# EAGLE design expander8 (EAGLE 6.1)
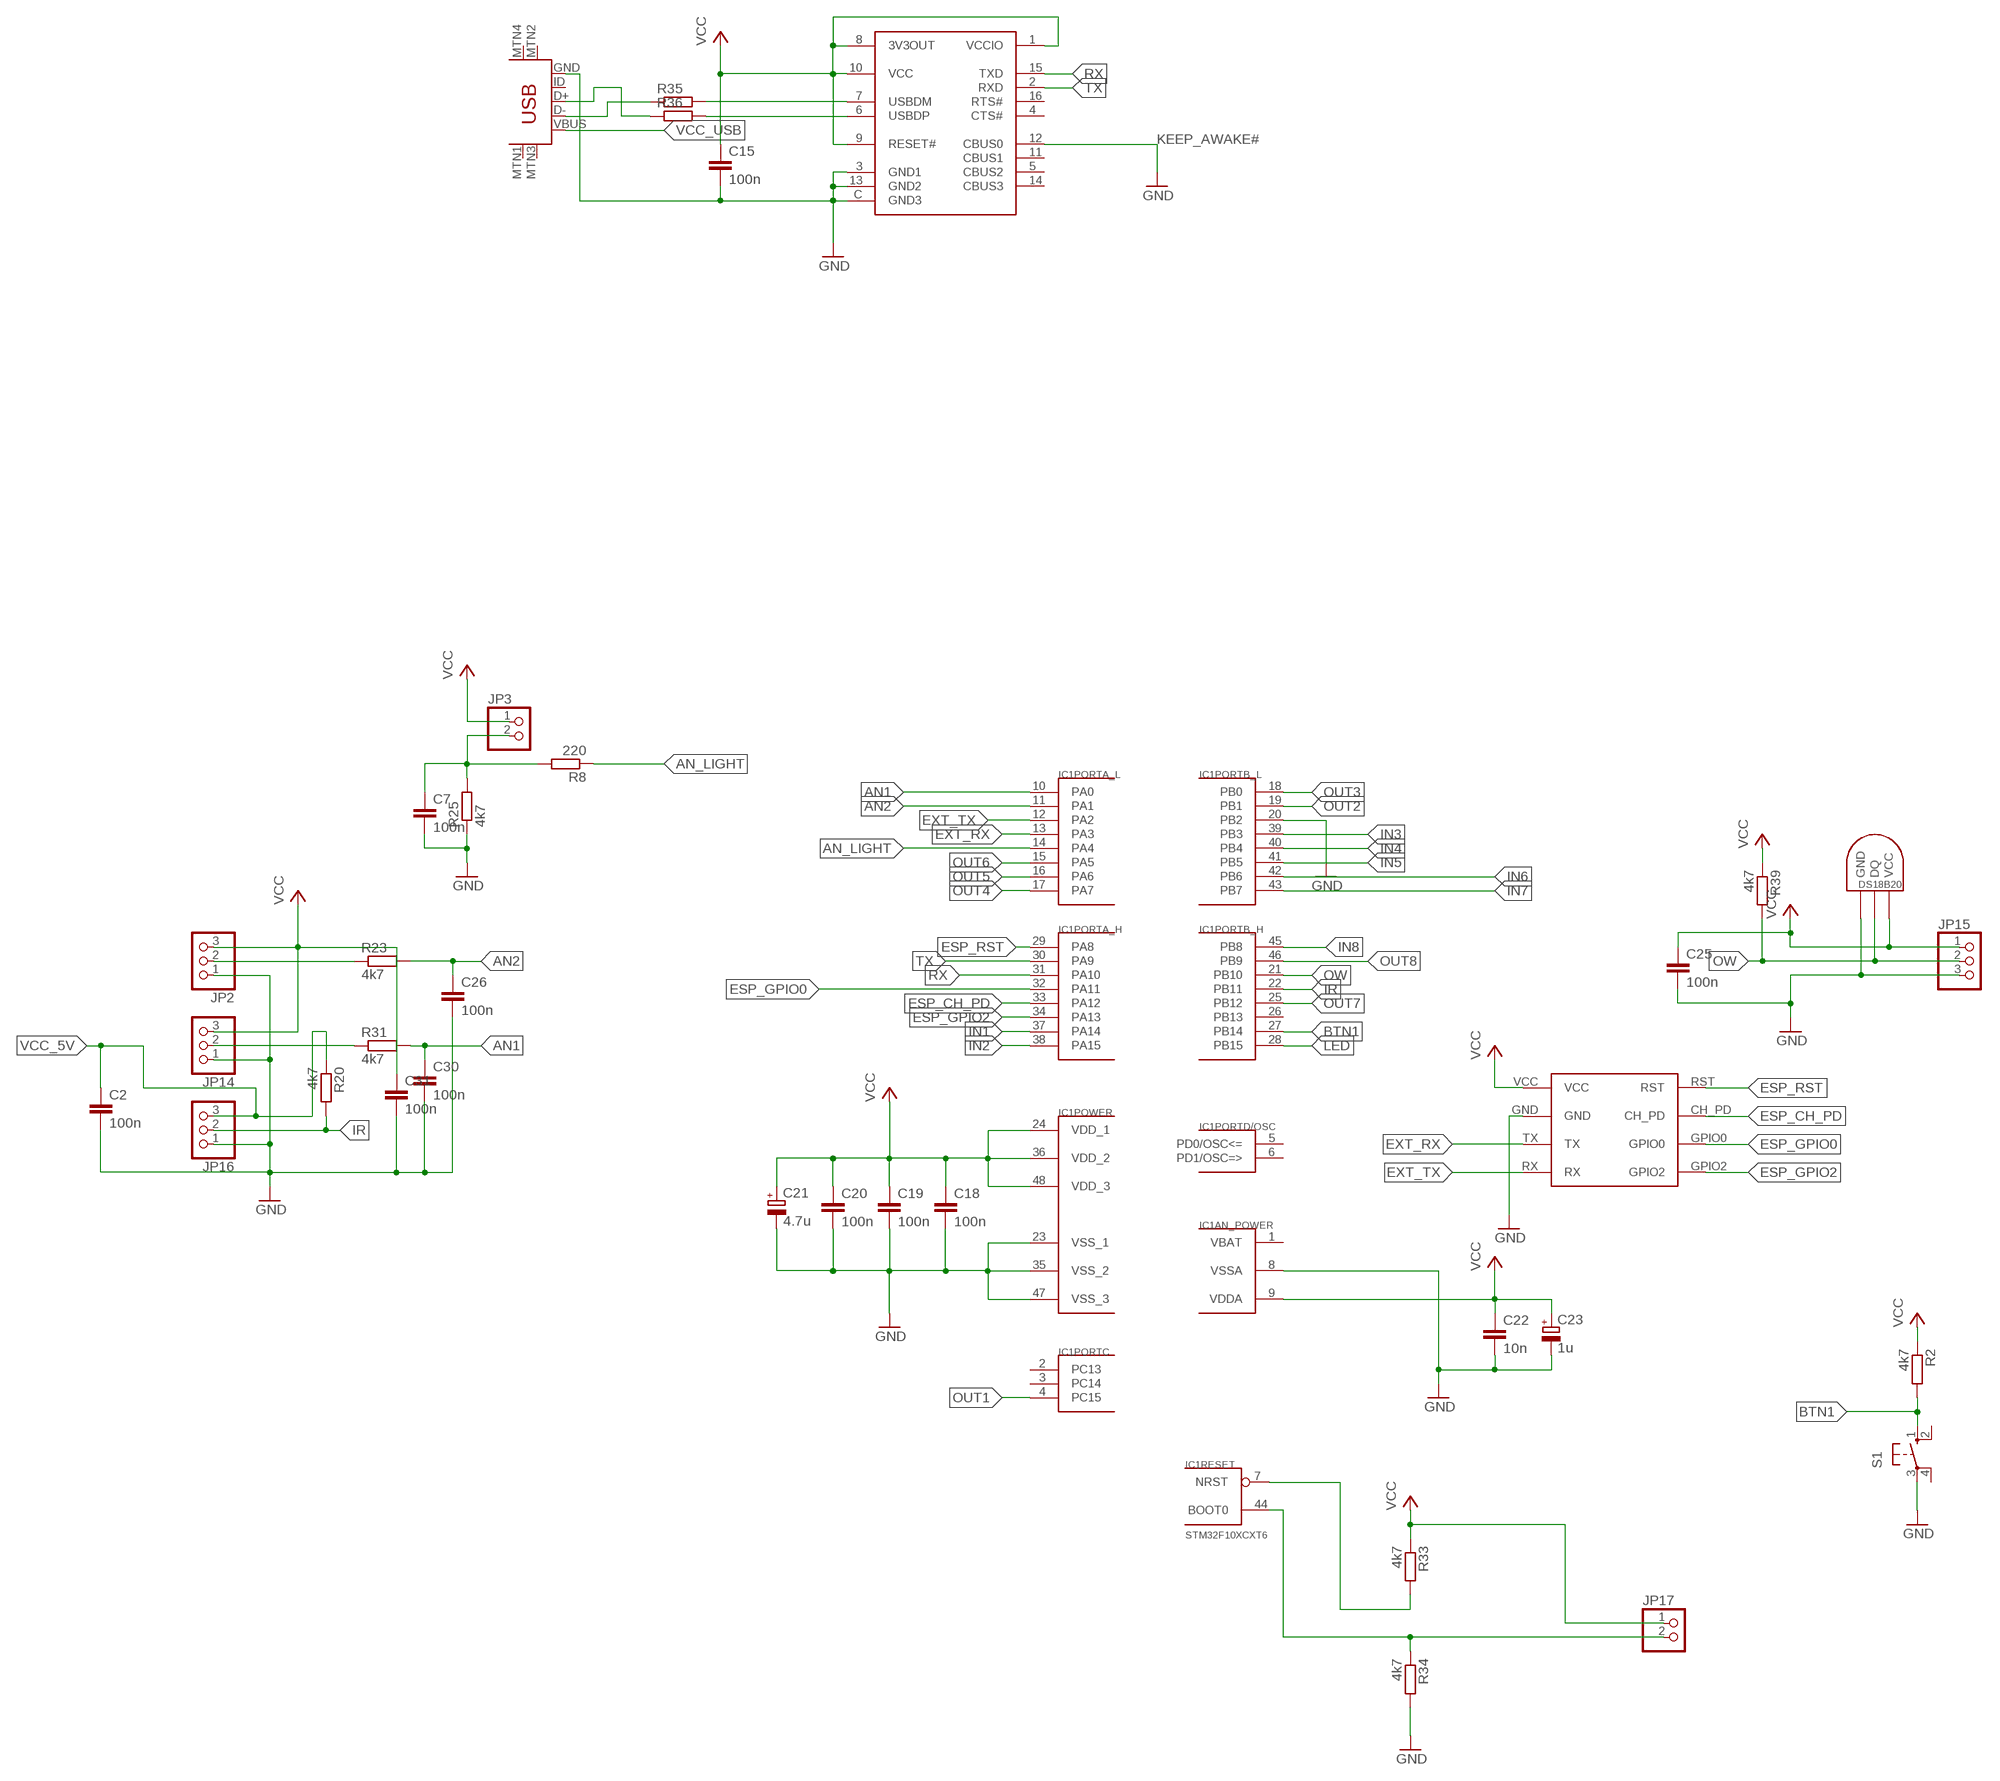
[diagram p0: schematic, sheet 1, part 1 of 3]
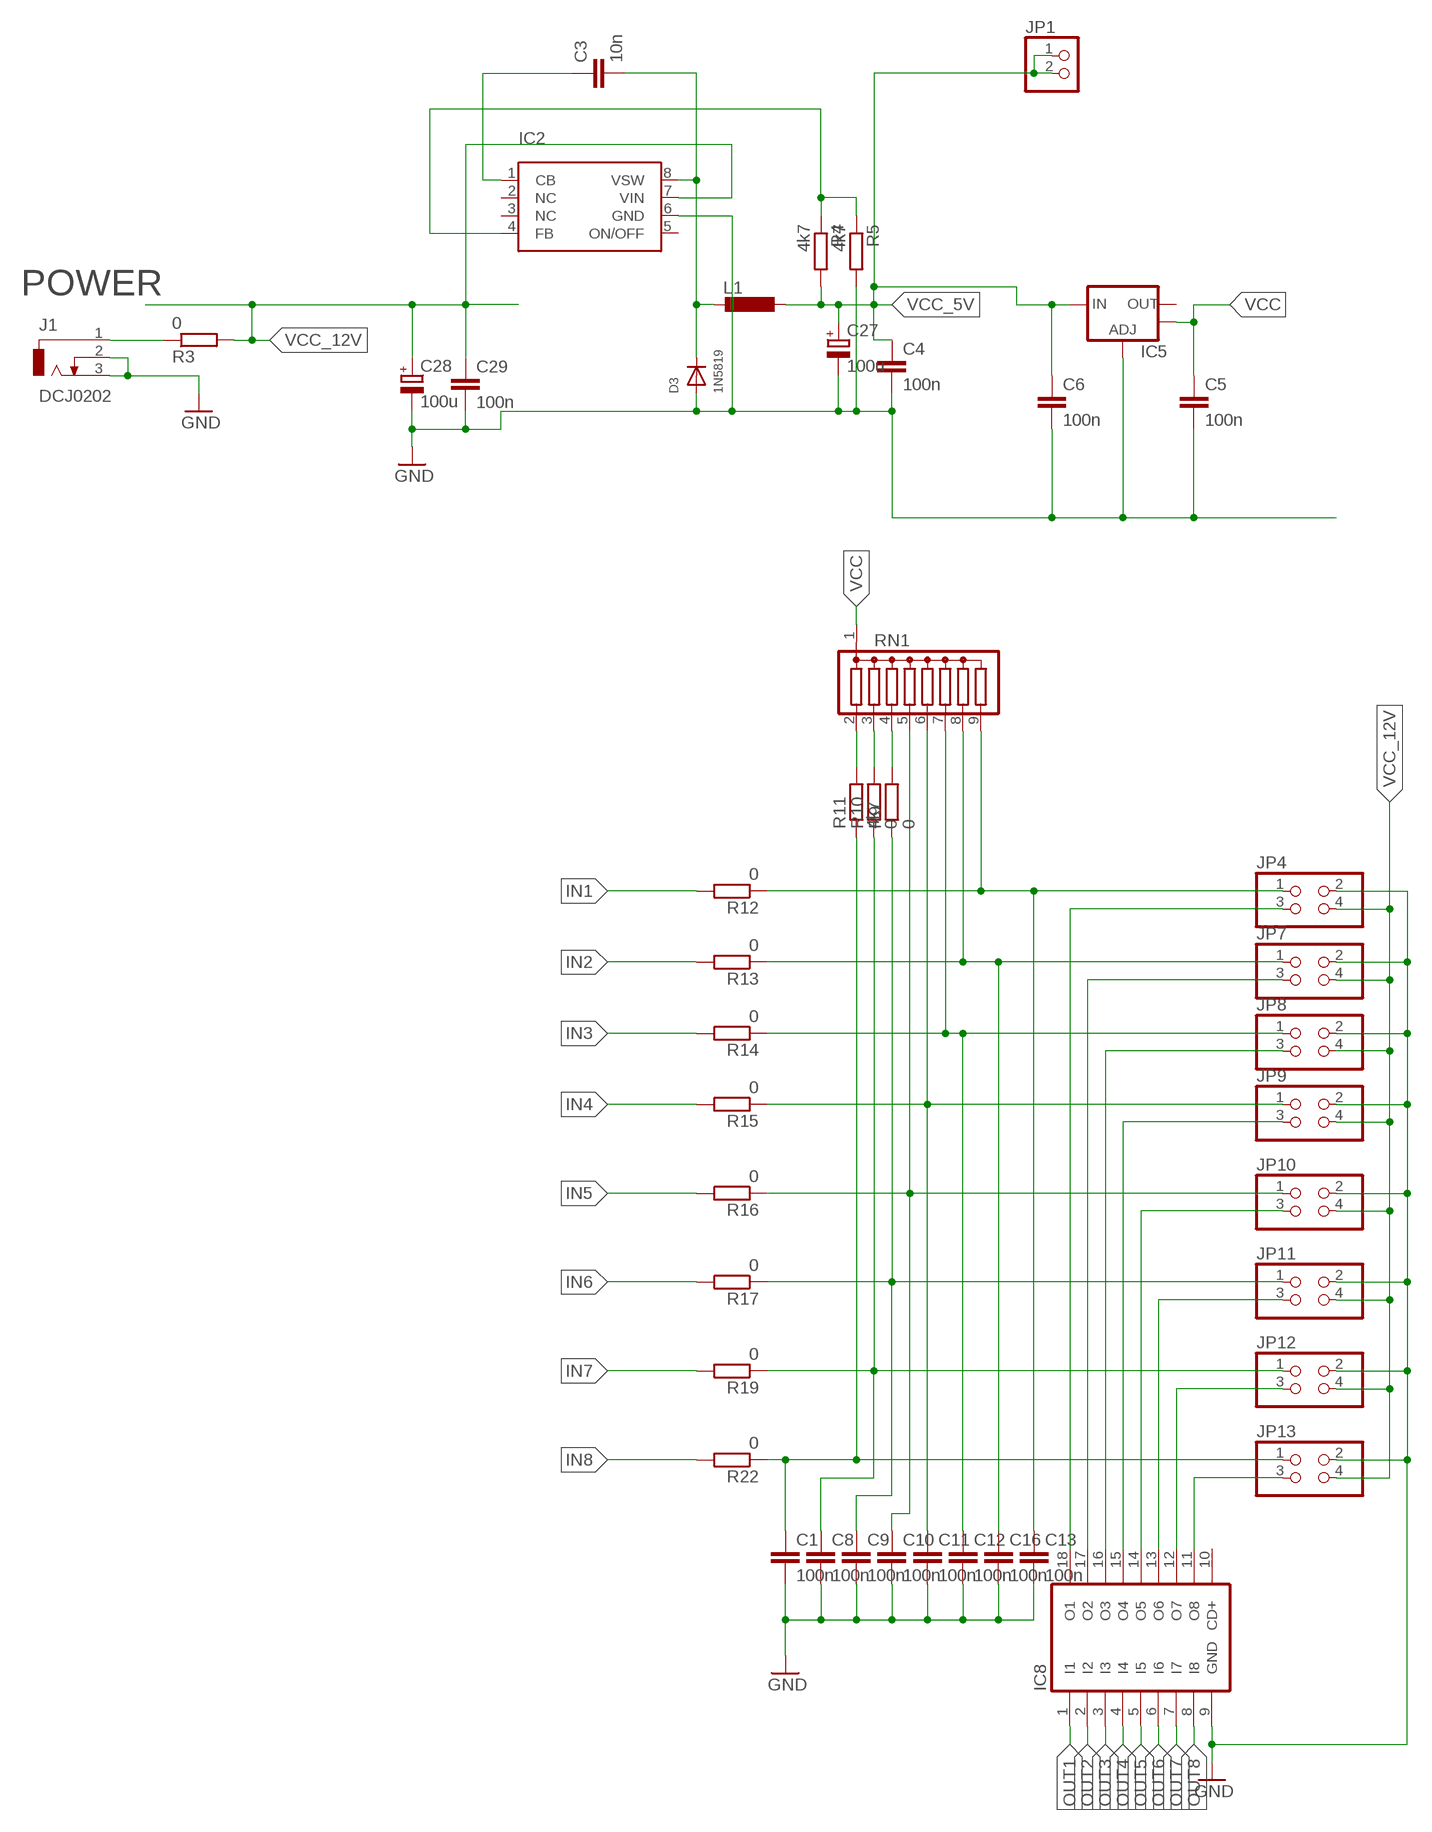
[diagram p1: schematic, sheet 1, part 2 of 3]
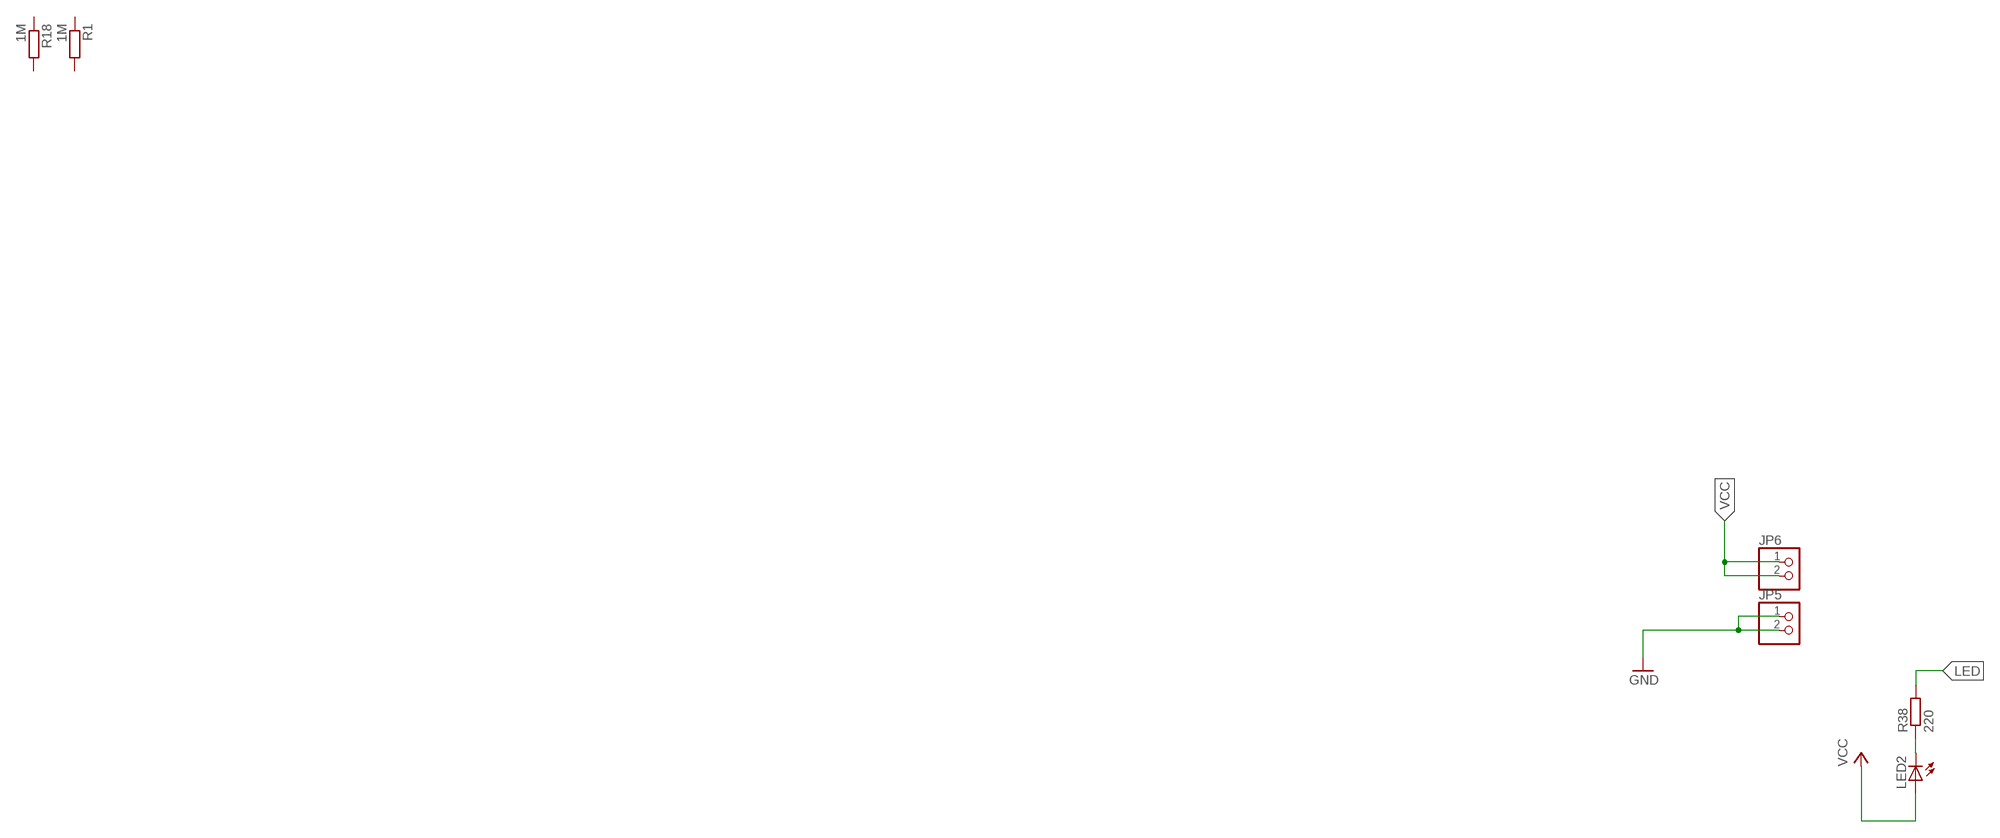
[diagram p2: schematic, sheet 1, part 3 of 3]

## Parts
C1  100n  C-EUC0805  [C0805]
C2  100n  C-EUC0805  [C0805]
C3  10n  C-EUC1206  [C1206]
C4  100n  C-EUC0805  [C0805]
C5  100n  C-EUC0805  [C0805]
C6  100n  C-EUC0805  [C0805]
C7  100n  C-EUC0805  [C0805]
C8  100n  C-EUC0805  [C0805]
C9  100n  C-EUC0805  [C0805]
C10  100n  C-EUC0805  [C0805]
C11  100n  C-EUC0805  [C0805]
C12  100n  C-EUC0805  [C0805]
C13  100n  C-EUC0805  [C0805]
C15  100n  C-EUC0805  [C0805]
C16  100n  C-EUC0805  [C0805]
C18  100n  C-EUC0805  [C0805]
C19  100n  C-EUC0805  [C0805]
C20  100n  C-EUC0805  [C0805]
C21  4.7u  CPOL-EUE2.5-5  [E2,5-5]
C22  10n  C-EUC0805  [C0805]
C23  1u  CPOL-EUE2.5-5  [E2,5-5]
C25  100n  C-EUC0805  [C0805]
C26  100n  C-EUC0805  [C0805]
C27  100u  CPOL-EUE2.5-7  [E2,5-7]
C28  100u  CPOL-EUE2.5-7  [E2,5-7]
C29  100n  C-EUC0805  [C0805]
C30  100n  C-EUC0805  [C0805]
C31  100n  C-EUC1206  [C1206]
D3  1N5819  DIODESMA  [SMADIODE]
IC1  STM32F10XCXT6  [TQFP48]
IC2  LM2674  [SO8]
IC5  V_REG_LM1117SOT223  [SOT223]
IC8  ULN2803AD  [SO18W]
J1  DCJ0202  [DCJ0202]
JP1  PINHD-1X2_2.54  [1X02]
JP2  PINHD-1X3  [1X03]
JP3  PINHD-1X2  [1X02]
JP4  PINHD-2X2/90  [2X02/90]
JP5  PINHD-1X2  [1X02]
JP6  PINHD-1X2  [1X02]
JP7  PINHD-2X2/90  [2X02/90]
JP8  PINHD-2X2/90  [2X02/90]
JP9  PINHD-2X2/90  [2X02/90]
JP10  PINHD-2X2/90  [2X02/90]
JP11  PINHD-2X2/90  [2X02/90]
JP12  PINHD-2X2/90  [2X02/90]
JP13  PINHD-2X2/90  [2X02/90]
JP14  PINHD-1X3  [1X03]
JP15  PINHD-1X3  [1X03]
JP16  PINHD-1X3  [1X03]
JP17  PINHD-1X2_2.54  [1X02]
L1  L-EU0207/2V  [0207/2V]
LED2  LEDCHIPLED_0805  [CHIPLED_0805]
R1  1M  R-EU_R1206  [R1206]
R2  4k7  R-EU_R0805  [R0805]
R3  0  R-EU_M1206  [M1206]
R4  4k7  R-EU_R0805  [R0805]
R5  4k7  R-EU_R0805  [R0805]
R8  220  R-EU_R1206  [R1206]
R9  0  R-EU_R0805  [R0805]
R10  0  R-EU_R0805  [R0805]
R11  4k7  R-EU_R0805  [R0805]
R12  0  R-EU_R0805  [R0805]
R13  0  R-EU_R0805  [R0805]
R14  0  R-EU_R0805  [R0805]
R15  0  R-EU_R0805  [R0805]
R16  0  R-EU_R0805  [R0805]
R17  0  R-EU_R0805  [R0805]
R18  1M  R-EU_R1206  [R1206]
R19  0  R-EU_R0805  [R0805]
R20  4k7  R-EU_R0805  [R0805]
R22  0  R-EU_R0805  [R0805]
R23  4k7  R-EU_R0805  [R0805]
R25  4k7  R-EU_R0805  [R0805]
R31  4k7  R-EU_R1206  [R1206]
R33  4k7  R-EU_R0805  [R0805]
R34  4k7  R-EU_R0805  [R0805]
R35  R-EU_R1206  [R1206]
R36  R-EU_R0805  [R0805]
R38  220  R-EU_R0805  [R0805]
R39  4k7  R-EU_R0805  [R0805]
RN1  G08R  [SIL9]
S1  10-XX  [B3F-10XX]
U$1  ESP8266  [ESP8266]
U$2  USB-MINIB-5PIN  [USB-MINIB]
U$3  FT230XQ  [FT230XQ]
U$4  DS1820TO92  [DS1820]

## Nets
AN1: C30.1 IC1.10(PORTA_L:PA0) R31.2
AN2: C26.1 IC1.11(PORTA_L:PA1) R23.2
AN_LIGHT: IC1.14(PORTA_L:PA4) R8.1
AN_LIGHT2: C7.1 JP3.2 R8.2 R25.2
BTN1: IC1.27(PORTB_H:PB14) R2.2 S1.1(S)
ESP_CH_PD: IC1.33(PORTA_H:PA12) U$1.CH_PD
ESP_GPIO0: IC1.32(PORTA_H:PA11) U$1.GPIO0
ESP_GPIO2: IC1.34(PORTA_H:PA13) U$1.GPIO2
ESP_RST: IC1.29(PORTA_H:PA8) U$1.RST
EXT_RX: IC1.13(PORTA_L:PA3) U$1.TX
EXT_TX: IC1.12(PORTA_L:PA2) U$1.RX
GND: C1.2 C2.2 C4.2 C5.2 C6.2 C7.2 C8.2 C9.2 C10.2 C11.2 C12.2 C13.2 C15.2 C16.2 C18.2 C19.2 C20.2 C21.- C22.2 C23.- C25.2 C26.2 C27.- C28.- C29.2 C30.2 C31.2 D3.A IC1.8(AN_POWER:VSSA) IC1.20(PORTB_L:PB2) IC1.23(POWER:VSS_1) IC1.35(POWER:VSS_2) IC1.47(POWER:VSS_3) IC2.6(GND) IC5.1(ADJ) IC8.9(GND) J1.2 J1.3 JP2.1 JP4.2 JP5.1 JP5.2 JP7.2 JP8.2 JP9.2 JP10.2 JP11.2 JP12.2 JP13.2 JP14.1 JP15.3 JP16.1 R5.2 R25.1 R34.2 S1.3(P) U$1.GND U$2.GND U$3.3(GND1) U$3.12(CBUS0) U$3.13(GND2) U$3.C(GND3) U$4.GND
IN1: IC1.37(PORTA_H:PA14) R12.2
IN1_: C13.1 JP4.1 R12.1 RN1.9
IN2: IC1.38(PORTA_H:PA15) R13.2
IN2_: C16.1 JP7.1 R13.1 RN1.8
IN3: IC1.39(PORTB_L:PB3) R14.2
IN3_: C12.1 JP8.1 R14.1 RN1.7
IN4: IC1.40(PORTB_L:PB4) R15.2
IN4_: C11.1 JP9.1 R15.1 RN1.6
IN5: IC1.41(PORTB_L:PB5) R16.2
IN5_: C10.1 JP10.1 R16.1 RN1.5
IN6: IC1.42(PORTB_L:PB6) R17.2
IN6_: C9.1 JP11.1 R9.1 R17.1
IN7: IC1.43(PORTB_L:PB7) R19.2
IN7_: C8.1 JP12.1 R10.1 R19.1
IN8: IC1.45(PORTB_H:PB8) R22.2
IN8_: C1.1 JP13.1 R11.1 R22.1
IR: IC1.22(PORTB_H:PB11) JP16.2 R20.2
LED: IC1.28(PORTB_H:PB15) R38.2
N$1: C3.2 D3.C IC2.8(VSW) L1.2
N$2: IC2.4(FB) R4.1 R5.1
N$3: IC8.18(O1) JP4.3
N$5: IC8.17(O2) JP7.3
N$6: C3.1 IC2.1(CB)
N$7: J1.1 R3.1
N$11: IC8.16(O3) JP8.3
N$12: R9.2 RN1.4
N$13: IC8.15(O4) JP9.3
N$14: R10.2 RN1.3
N$15: R11.2 RN1.2
N$23: IC8.14(O5) JP10.3
N$24: IC8.13(O6) JP11.3
N$25: IC8.12(O7) JP12.3
N$26: LED2.C R38.1
N$29: IC8.11(O8) JP13.3
N$31: JP2.2 R23.1
N$32: JP14.2 R31.1
N$38: R35.1 U$2.D-
N$39: R35.2 U$3.7(USBDM)
N$40: R36.2 U$3.6(USBDP)
N$41: R36.1 U$2.D+
N$64: IC1.44(RESET:BOOT0) JP17.2 R34.1
OUT1: IC1.4(PORTC:PC15) IC8.1(I1)
OUT2: IC1.19(PORTB_L:PB1) IC8.2(I2)
OUT3: IC1.18(PORTB_L:PB0) IC8.3(I3)
OUT4: IC1.17(PORTA_L:PA7) IC8.4(I4)
OUT5: IC1.16(PORTA_L:PA6) IC8.5(I5)
OUT6: IC1.15(PORTA_L:PA5) IC8.6(I6)
OUT7: IC1.25(PORTB_H:PB12) IC8.7(I7)
OUT8: IC1.46(PORTB_H:PB9) IC8.8(I8)
OW: IC1.21(PORTB_H:PB10) JP15.2 R39.2 U$4.DQ
RST1: IC1.7(RESET:NRST) R33.2
RX: IC1.31(PORTA_H:PA10) U$3.15(TXD)
TX: IC1.30(PORTA_H:PA9) U$3.2(RXD)
VCC: C5.1 C15.1 C18.1 C19.1 C20.1 C21.+ C22.1 C23.+ C25.1 C31.1 IC1.9(AN_POWER:VDDA) IC1.24(POWER:VDD_1) IC1.36(POWER:VDD_2) IC1.48(POWER:VDD_3) IC5.4(OUT) JP2.3 JP3.1 JP6.1 JP6.2 JP14.3 JP15.1 JP17.1 LED2.A R2.1 R33.1 R39.1 RN1.1 U$1.VCC U$3.1(VCCIO) U$3.8(3V3OUT) U$3.9(RESET#) U$3.10(VCC) U$4.VDD(VCC)
VCC_5V: C2.1 C4.1 C6.1 C27.+ IC5.3(IN) JP1.1 JP1.2 JP16.3 L1.1 R4.2 R20.1
VCC_12V: C28.+ C29.1 IC2.7(VIN) JP4.4 JP7.4 JP8.4 JP9.4 JP10.4 JP11.4 JP12.4 JP13.4 R3.2
VCC_USB: U$2.VBUS
Unconnected: IC1.2(PORTC:PC13) IC1.3(PORTC:PC14) IC1.5(PORTD/OSC:PD0/OSC<=) IC1.6(PORTD/OSC:PD1/OSC=>) IC1.26(PORTB_H:PB13) IC2.2(NC) IC2.3(NC) IC2.5(ON/OFF) IC5.2(OUT) IC8.10(CD+) R1.1 R1.2 R18.1 R18.2 S1.2(S1) S1.4(P1) U$2.ID U$2.MTN1(MTN2) U$2.MTN2(MTN3) U$2.MTN3(MTN1) U$2.MTN4 U$3.4(CTS#) U$3.5(CBUS2) U$3.11(CBUS1) U$3.14(CBUS3) U$3.16(RTS#)

## Notes on the sheet
- POWER
- KEEP_AWAKE#

## Power pins joined to a net without a drawn wire
VBAT: IC1.1(AN_POWER:VBAT)

## Library data of the parts
C1-C13 C15 C16 C18-C20 C22 C26 C29-C31 = rcl-kd:C-EU: CAPACITOR, European symbol
C21 C23 C27 C28 = rcl-kd:CPOL-EU: POLARIZED CAPACITOR, European symbol
C25 = resistor:C-EU: CAPACITOR, European symbol
D3 = adafruit:DIODE: Diode SMADIODE - SMA Surface Mount Package 20V 1A Schottky Diode Digikey: 641-1014-6-ND DO-1N4148 - Through Hole Small Current Diode SOD-123 20V 1 A (.5mV Vf) Schottky Diode - Digikey: MBRX120TPMSCT-ND SOD-323 10V 570mA (.38mV Vf, 3ns) Schottky Diode - Digikey: ZLLS410CT-ND SOD-523 30V 30mA Schottky Diode (RB751S-40TE61) - Digikey: RB751S-40TE61CT-ND SOT23-R/W - SOT23 Package (R = Solder Paste/Reflow Ovens, W = Hand-Soldering) BAT54Film 40V 300mA - Digikey: 497-7162-1-ND
IC1 = stm32:STM32F10XCXT6: ST STM32F101/103 48pin LQFP
IC2 = lm2674:LM2674
IC5 = SparkFun:V_REG_LM1117: Voltage Regulator LM1117 Standard adjustable voltage regulator but in SMD form. Spark Fun Electronics SKU : COM-00595
IC8 = uln-udn:ULN2803A: DRIVER ARRAY
J1 = con-jack:DCJ0202: DC POWER JACK Source: DCJ0202.pdf; OC_FARNELL: unknown; OC_NEWARK: unknown
JP1 JP17 = pinhead:PINHD-1X2: PIN HEADER
JP2 JP14-JP16 = pinhead:PINHD-1X3: PIN HEADER
JP3 JP5 JP6 = pinhead-kd:PINHD-1X2: PIN HEADER
JP4 JP7-JP13 = pinhead-kd:PINHD-2X2: PIN HEADER
L1 = rcl-kd:L-EU: INDUCTOR, European symbol
LED2 = adafruit:LED: LED OSRAM: - CHIPLED LG R971, LG N971, LY N971, LG Q971, LY Q971, LO R971, LY R971 LH N974, LH R974 LS Q976, LO Q976, LY Q976 LO Q996 - Hyper CHIPLED LW Q18S LB Q993, LB Q99A, LB R99A - SideLED LS A670, LO A670, LY A670, LG A670, LP A670 LB A673, LV A673, LT A673, LW A673 LH A674 LY A675 LS A676, LA A676, LO A676, LY A676, LW A676 LS A679, LY A679, LG A679 - Hyper Micro SIDELED® LS Y876, LA Y876, LO Y876, LY Y876 LT Y87S - SmartLED LW L88C, LW L88S LB L89C, LB L89S, LG L890 LS L89K, LO L89K, LY L89K LS L896, LA L896, LO L896, LY L896 - TOPLED LS T670, LO T670, LY T670, LG T670, LP T670 LSG T670, LSP T670, LSY T670, LOP T670, LYG T670 LG T671, LOG T671, LSG T671 LB T673, LV T673, LT T673, LW T673 LH T674 LS T676, LA T676, LO T676, LY T676, LB T676, LH T676, LSB T676, LW T676 LB T67C, LV T67C, LT T67C, LS T67K, LO T67K, LY T67K, LW E67C LS E67B, LA E67B, LO E67B, LY E67B, LB E67C, LV E67C, LT E67C LW T67C LS T679, LY T679, LG T679 LS T770, LO T770, LY T770, LG T770, LP T770 LB T773, LV T773, LT T773, LW T773 LH T774 LS E675, LA E675, LY E675, LS T675 LS T776, LA T776, LO T776, LY T776, LB T776 LHGB T686 LT T68C, LB T68C - Hyper Mini TOPLED® LB M676 - Mini TOPLED Santana® LG M470 LS M47K, LO M47K, LY M47K Source: http://www.osram.convergy.de/
R1 R2 R18 R33 R34 = rcl-kd:R-EU_: RESISTOR, European symbol
R3 = rcl:R-EU_: RESISTOR, European symbol
R4 R5 R8-R17 R19 R20 R22 R23 R25 R31 R35 R36 R38 R39 = resistor:R-EU_: RESISTOR, European symbol
RN1 = resistor-sil:G08R: SIL RESISTOR; OC_FARNELL: unknown; OC_NEWARK: unknown
S1 = switch-omron:10-XX: OMRON SWITCH; MPN: B3F-1000; OC_FARNELL: 176432; OC_NEWARK: 36M3542
U$1 = kd:ESP8266
U$2 = SparkFun:USB-MINIB: Mini-USB "B" connector with 5th pin broken out. Created new symbol breaking out 5th "ID" pin in mini/micro USB connector spec. See: http://en.wikipedia.org/wiki/Mini_usb#Cables. Uses same footprint as 4-pin symbol. Also added pins to connect to mounting / shield pads if required (probably not generally needed as signals aren't shielded once they leave the connector).
U$3 = ftdi_ft231xq-r2:FT230XQ
U$4 = Ava_ds18:DS1820: DS18B20 Programmable Resolution 1-Wire Digital Thermometer Description The DS18B20 digital thermometer provides 9-bit to 12-bit Celsius temperature measurements and has an alarm function with nonvolatile user-programmable upper and lower trigger points. The DS18B20 communicates over a 1-Wire® bus that by definition requires only one data line (and ground) for communication with a central microprocessor. It has an operating temperature range of -55°C to +125°C and is accurate to ±0.5°C over the range of -10°C to +85°C. In addition, the DS18B20 can derive power directly from the data line ("parasite power"), eliminating the need for an external power supply. Each DS18B20 has a unique 64-bit serial code, which allows multiple DS18B20s to function on the same 1-Wire bus. Thus, it is simple to use one microprocessor to control many DS18B20s distributed over a large area. Applications that can benefit from this feature include HVAC environmental controls, temperature monitoring systems inside buildings, equipment, or machinery, and process monitoring and control systems.

## Board
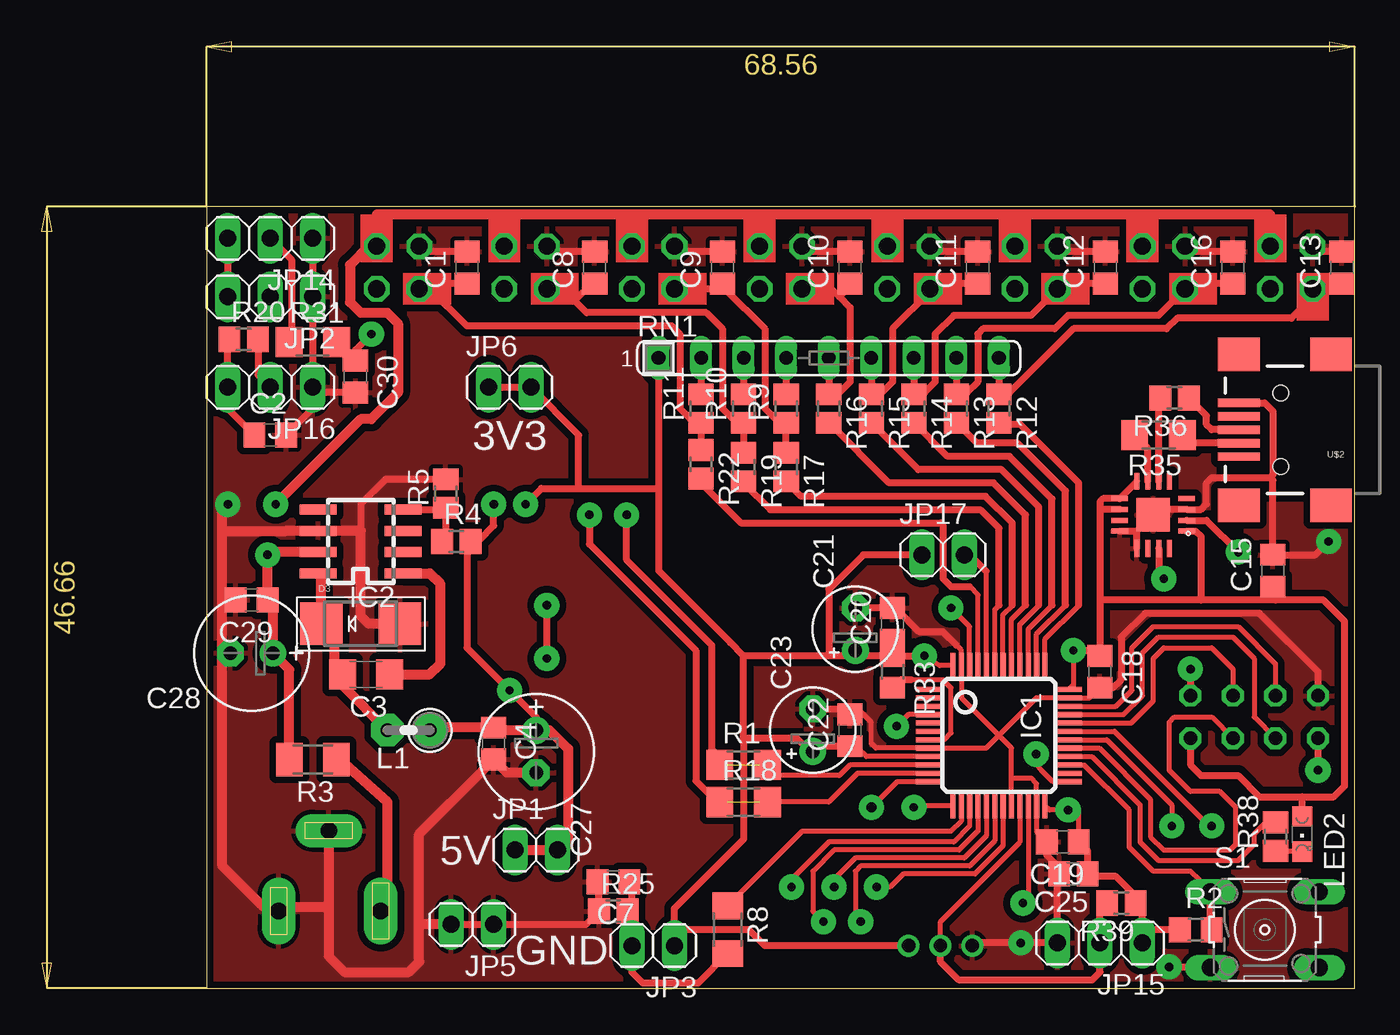
[diagram p3: board, top side]
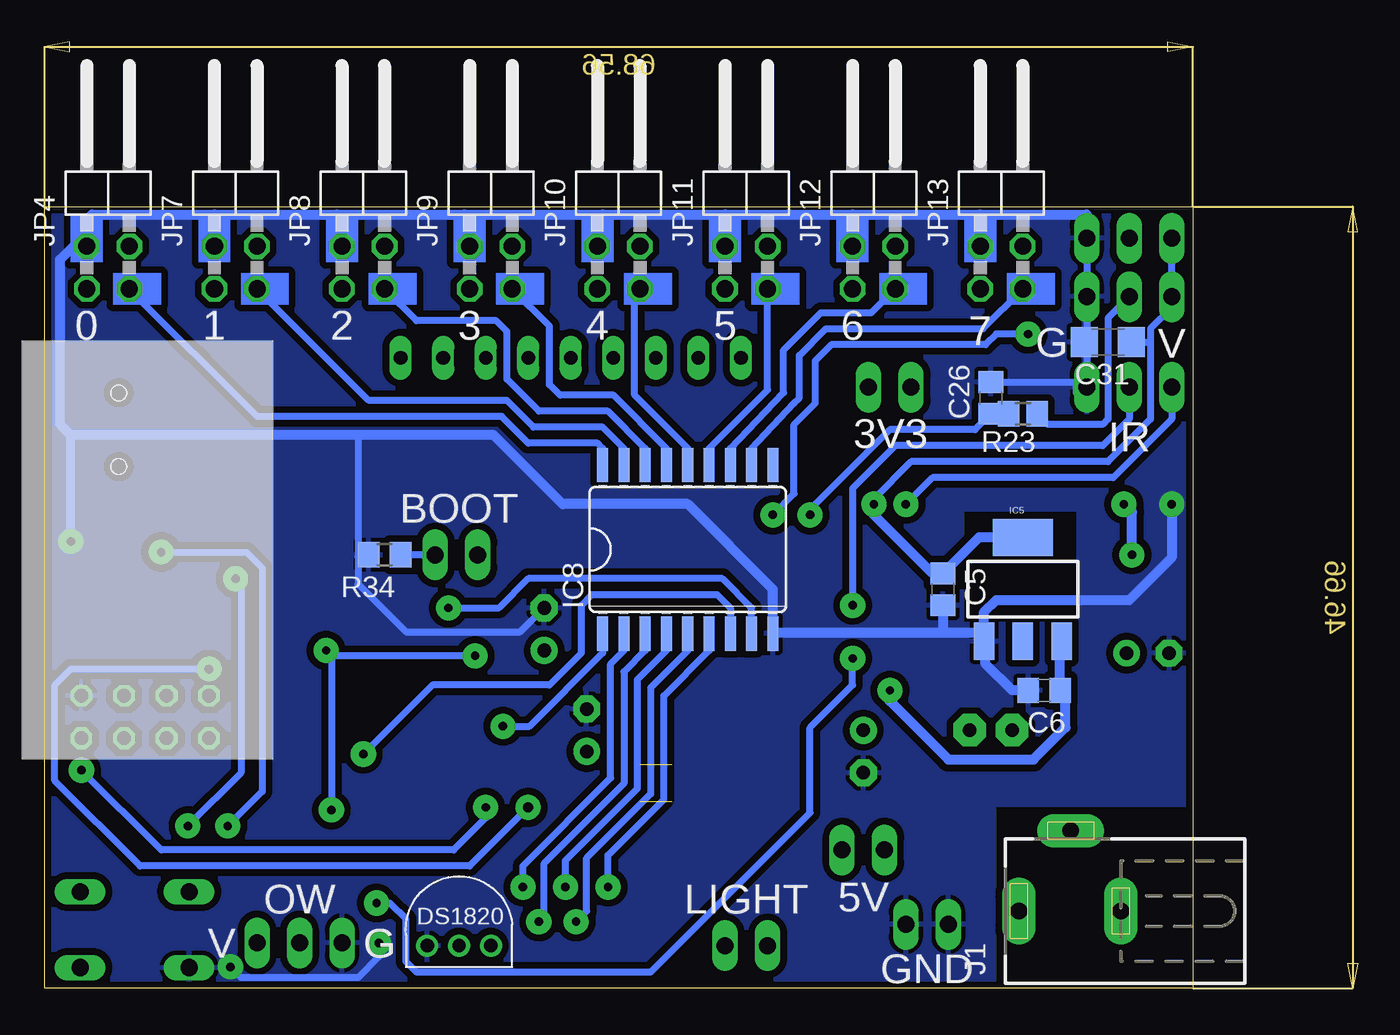
[diagram p4: board, bottom side, seen from below]

Size 68.56 x 46.66 mm. Coordinates in mm from the lower left corner, seen from the top.
Outline: 0,0 68.56,0 68.56,46.66 0,46.66 0,0
Copper layers (1*16): Top 0.035mm / dielectric 1.5mm / Bottom 0.035mm
Design rules: minimum track width 10mil, minimum drill 12mil, track to track 4mil, track to pad 4mil, pad to pad 4mil, via to via 4mil, smd to smd 4mil, copper to edge 10mil, drill to drill 8mil, minimum pad ring 10mil, minimum via ring 8mil, stop-mask expansion 4mil, vias tented up to drill 0mil, thermal gap 10mil

### Footprints (pad centres in the part's own frame; a part is rotated, then mirrored left to right if it is on the bottom)
C0805 = smd 1.3 x 1.5: 1 -0.95,0; 2 0.95,0
C1206 = smd 1.6 x 1.8: 1 -1.4,0; 2 1.4,0
E2,5-5 = drill 0.813 pad 1.6: + -1.27,0 | drill 0.813 pad 1.6 octagon: - 1.27,0
C0805' = smd 1.3 x 1.5: 1 -0.85,0; 2 0.85,0
E2,5-7 = drill 0.813 pad 1.6: + -1.27,0 | drill 0.813 pad 1.6 octagon: - 1.27,0
SMADIODE = smd 2.54 x 2.54: A 2.349,0; C -2.349,0
TQFP48 = smd 0.305 x 1.524: 1 -2.75,-4.183; 2 -2.25,-4.183; 3 -1.75,-4.183; 4 -1.25,-4.183; 5 -0.75,-4.183; 6 -0.25,-4.183; 7 0.25,-4.183; 8 0.75,-4.183; 9 1.25,-4.183; 10 1.75,-4.183; 11 2.25,-4.183; 12 2.75,-4.183; 25 2.75,4.183; 26 2.25,4.183; 27 1.75,4.183; 28 1.25,4.183; 29 0.75,4.183; 30 0.25,4.183; 31 -0.25,4.183; 32 -0.75,4.183; 33 -1.25,4.183; 34 -1.75,4.183; 35 -2.25,4.183; 36 -2.75,4.183 | smd 1.524 x 0.305: 13 4.183,-2.75; 14 4.183,-2.25; 15 4.183,-1.75; 16 4.183,-1.25; 17 4.183,-0.75; 18 4.183,-0.25; 19 4.183,0.25; 20 4.183,0.75; 21 4.183,1.25; 22 4.183,1.75; 23 4.183,2.25; 24 4.183,2.75; 37 -4.183,2.75; 38 -4.183,2.25; 39 -4.183,1.75; 40 -4.183,1.25; 41 -4.183,0.75; 42 -4.183,0.25; 43 -4.183,-0.25; 44 -4.183,-0.75; 45 -4.183,-1.25; 46 -4.183,-1.75; 47 -4.183,-2.25; 48 -4.183,-2.75
SO8 = smd 0.6 x 2.2: 1 -1.905,-2.54; 2 -0.635,-2.54; 3 0.635,-2.54; 4 1.905,-2.54; 5 1.905,2.54; 6 0.635,2.54; 7 -0.635,2.54; 8 -1.905,2.54
SOT223 = smd 1.219 x 2.235: 1 -2.311,-3.099; 2 0,-3.099; 3 2.311,-3.099 | smd 3.6 x 2.2: 4 0,3.099
SO18W = smd 0.66 x 2.032: 1 -5.08,-5.029; 2 -3.81,-5.029; 3 -2.54,-5.029; 4 -1.27,-5.029; 5 0,-5.029; 6 1.27,-5.029; 7 2.54,-5.029; 8 3.81,-5.029; 9 5.08,-5.029; 10 5.08,5.029; 11 3.81,5.029; 12 2.54,5.029; 13 1.27,5.029; 14 0,5.029; 15 -1.27,5.029; 16 -2.54,5.029; 17 -3.81,5.029; 18 -5.08,5.029
DCJ0202 = drill 1 pad 2 long: 1 0,3.1; 2 4.8,0; 3 0,-3
1X02 = drill 1.016 long: 1 -1.27,0; 2 1.27,0
1X03 = drill 1.016 long: 1 -2.54,0; 2 0,0; 3 2.54,0
2X02/90 = drill 1.016 octagon: 1 -1.27,-6.35; 2 -1.27,-3.81; 3 1.27,-6.35; 4 1.27,-3.81
0207/2V = drill 0.813 pad 1.93 octagon: 1 -1.27,0; 2 1.27,0
CHIPLED_0805 = smd 1.2 x 1.2: A 0,-1.05; C 0,1.05
R1206 = smd 1.6 x 1.803: 1 -1.422,0; 2 1.422,0
R0805 = smd 1.3 x 1.5: 1 -0.95,0; 2 0.95,0
M1206 = smd 1.6 x 2: 1 -1.4,0; 2 1.4,0
R0805' = smd 1.3 x 1.5: 1 -0.85,0; 2 0.85,0
SIL9 = drill 0.813 long: 1 -10.16,0; 2 -7.62,0; 3 -5.08,0; 4 -2.54,0; 5 0,0; 6 2.54,0; 7 5.08,0; 8 7.62,0; 9 10.16,0
B3F-10XX = drill 1.016 long: 1 -3.251,2.261; 2 3.251,2.261; 3 -3.251,-2.261; 4 3.251,-2.261
ESP8266 = drill 0.8 octagon: CH_PD 1.27,8.89; GND 3.81,11.43; GPIO0 3.81,6.35; GPIO2 3.81,8.89; RST 1.27,6.35; RX 3.81,3.81; TX 1.27,11.43; VCC 1.27,3.81
USB-MINIB = smd 2.5 x 0.5: D+ 2.5,0; D- 2.5,0.8; GND 2.5,-1.6; ID 2.5,-0.8; VBUS 2.5,1.6 | smd 2.5 x 2: MTN1 -3,4.5; MTN2 2.5,4.5; MTN3 -3,-4.5; MTN4 2.5,-4.5 | hole 0.9: 0,2.2; 0,-2.2
FT230XQ = smd 1 x 0.3: 1 -2,0.975; 2 -2,0.325; 3 -2,-0.325; 4 -2,-0.975; 9 2,-0.975; 10 2,-0.325; 11 2,0.325; 12 2,0.975 | smd 0.3 x 1: 5 -0.975,-2; 6 -0.325,-2; 7 0.325,-2; 8 0.975,-2; 13 0.975,2; 14 0.325,2; 15 -0.325,2; 16 -0.975,2 | smd 2 x 2: C 0,0
DS1820 = drill 0.8: DQ 2.54,-1.27; GND 0.635,-1.27; VDD 4.445,-1.27

### Placement (x,y rotation side)
C1  15.56,43.02 90 top
C2  3.81,33.02 0 top
C3  9.53,18.73 180 top
C4  17.14,14.6 270 top
C5  14.92,23.81 270 bottom
C6  8.89,17.78 180 bottom
C7  24.29,6.35 180 top
C8  23.18,43.02 90 top
C9  30.8,43.02 90 top
C10  38.42,43.02 90 top
C11  46.04,43.02 90 top
C12  53.66,43.02 90 top
C13  67.79,43.02 90 top
C15  63.66,24.92 90 top
C16  61.28,43.02 90 top
C18  53.34,18.89 270 top
C19  51.12,8.73 180 top
C20  40.96,21.75 90 top
C21  38.73,21.43 90 top
C22  38.42,15.4 90 top
C23  36.2,15.4 90 top
C25  100n  [C0805']  51.75,6.83 180 top
C26  12.06,35.24 90 bottom
C27  19.68,14.13 270 top
C28  2.7,20 180 top
C29  2.7,23.18 180 top
C30  8.89,36.51 270 top
C31  5.08,38.58 180 bottom
D3  9.21,21.75 0 top
IC1  47.31,15.08 270 top
IC2  9.21,26.67 90 top
IC5  10.16,23.81 0 bottom
IC8  30.16,26.19 0 bottom
J1  7.3,4.6 90 bottom
JP1  19.68,8.25 0 top
JP2  3.81,41.27 180 top
JP3  26.67,2.54 180 top
JP4  64.77,48.1 0 bottom
JP5  15.88,3.81 180 top
JP6  18.1,35.88 0 top
JP7  57.15,48.1 0 bottom
JP8  49.53,48.1 0 bottom
JP9  41.91,48.1 0 bottom
JP10  34.29,48.1 0 bottom
JP11  26.67,48.1 0 bottom
JP12  19.05,48.1 0 bottom
JP13  11.43,48.1 0 bottom
JP14  3.81,44.77 180 top
JP15  53.34,2.7 180 top
JP16  3.81,35.88 180 top
JP17  43.97,25.88 0 top
L1  12.06,15.4 180 top
LED2  65.41,9.21 180 top
R1  32.07,13.33 0 top
R2  59.05,3.49 0 top
R3  6.35,13.65 180 top
R4  4k7  [R0805']  14.92,26.67 0 top
R5  4k7  [R0805']  14.29,29.53 90 top
R8  31.11,3.49 270 top
R9  0  [R0805']  34.61,34.61 90 top
R10  0  [R0805']  32.07,34.61 90 top
R11  4k7  [R0805']  29.53,34.61 90 top
R12  0  [R0805']  47.31,34.61 270 top
R13  0  [R0805']  44.77,34.61 270 top
R14  0  [R0805']  42.23,34.61 270 top
R15  0  [R0805']  39.69,34.61 270 top
R16  0  [R0805']  37.15,34.61 270 top
R17  0  [R0805']  34.61,31.11 270 top
R18  32.07,11.11 0 top
R19  0  [R0805']  32.07,31.11 270 top
R20  4k7  [R0805']  2.22,38.73 0 top
R22  0  [R0805']  29.53,31.27 270 top
R23  4k7  [R0805']  10.16,34.29 180 bottom
R25  4k7  [R0805']  24.29,4.6 0 top
R31  6.35,38.58 0 top
R33  40.96,18.89 270 top
R34  48.26,25.88 180 bottom
R35  56.83,33.02 180 top
R36  [R0805']  57.78,35.24 180 top
R38  220  [R0805']  63.82,9.05 90 top
R39  4k7  [R0805']  54.61,5.08 180 top
RN1  37.15,37.62 0 top
S1  63.18,3.49 0 top
U$1  54.93,13.65 90 bottom
U$2  64.14,33.34 180 top
U$3  56.52,28.26 180 top
U$4  46.35,3.81 0 bottom

### Tracks (layer width: path | path; a pad name or v marks a point on that pad's centre or on a via)
AN1  (via drill 0.5 pad 1.5)  (1 unrouted)
  Top 0.305: IC1.10 38.41,13.33 37.78,12.7 33.66,12.7 33.02,13.34
  Top 0.406: 31.11,13.34 30.16,14.29 30.16,20.48 25.08,25.56 v25.08,28.26 | R31.2 C30.1 8.89,38.1 v9.84,39.05
  Bottom 0.406: v25.08,28.26 23.81,29.53 23.81,33.65 22.54,34.93 22.54,37.46 21.59,38.42 12.38,38.42 11.75,39.05 v9.84,39.05
AN2  (via drill 0.5 pad 1.5)  (1 unrouted)
  Top 0.305: IC1.11 38.87,12.83 37.15,11.11 33.02,11.11
  Top 0.406: 31.11,11.11 30.48,11.11 29.21,12.38 29.21,20.16 22.86,26.51 v22.86,28.26
  Bottom 0.406: R23.2 C26.1 | C26.1 | C26.1 13.02,33.34 18.1,33.34 22.86,28.57 v22.86,28.26
AN_LIGHT
  Top 0.305: IC1.14 45.06,9.97 44.45,9.37 36.67,9.37 35.56,9.37 32.38,6.19 R8.1
AN_LIGHT2
  Top 0.406: 25.4,4.45 JP3.2 25.4,0.95 26.04,0.32 29.36,0.32 R8.2 | 25.4,4.45 25.4,5.87 C7.1 | R25.2 25.24,4.29 25.4,4.45
BTN1
  Top 0.305: S1.1 59.3,6.43 58.74,6.98 56.52,6.98 55.09,8.41 55.09,10.64 52.39,13.33 IC1.27
  Top 0.406: R2.2 59.93,3.49 S1.1
  cutout Bottom: 0,10.79 11.75,10.79 11.75,0 0,0
  cutout Bottom: 6.99,28.42 13.65,28.42 13.65,21.91 6.99,21.91
ESP_CH_PD
  Top 0.305: IC1.33 54.75,16.33 55.88,17.46 55.88,20 56.83,20.95 61.28,20.95 62.55,19.68 62.55,16.19 U$1.CH_PD
ESP_GPIO0
  Top 0.305: IC1.32 55.2,15.83 56.52,17.14 56.52,19.68 57.15,20.32 60.01,20.32 61.28,19.05 U$1.GPIO0
ESP_GPIO2
  Top 0.305: IC1.34 54.3,16.83 55.24,17.78 55.24,20.32 56.52,21.59 61.59,21.59 63.82,19.37 U$1.GPIO2
ESP_RST
  Top 0.305: IC1.29 53.3,14.33 56.36,11.27 56.36,9.05 57.15,8.25 61.12,8.25 61.44,8.57 61.44,10.79 60.48,11.75 58.74,11.75 57.47,13.02 57.47,15.87 57.78,16.19 60.01,16.19 U$1.RST
EXT_RX  (via drill 0.5 pad 1.5)
  Top 0.305: IC1.13 42.65,10.9 v42.23,10.79
  Top 0.406: v66.36,13.02 U$1.TX
  Bottom 0.406: v42.23,10.79 42.23,10.16 44.13,8.25 61.59,8.25 v66.36,13.02
EXT_TX  (via drill 0.5 pad 1.5, 0.6 pad 1.5)
  Top 0.305: IC1.12 41.22,12.33 v39.69,10.79
  Top 0.406: v58.74,19.05 U$1.RX
  Bottom 0.406: v39.69,10.79 43.18,7.3 62.87,7.3 67.94,12.38 67.94,18.1 66.99,19.05 v58.74,19.05
GND  (via drill 0.5 pad 1.5)
  Top 0.305: 47.31,15.08 49.56,17.33 IC1.35 52.73,17.33 C18.2 | 47.31,15.08 45.06,17.33 IC1.47 45.06,20.19 44.77,20.48 | 47.31,15.08 46.56,14.33 IC1.8 39.96,14.33 39.69,14.61 39.69,15.87 39.05,16.51 38.73,16.51 C22.2 | IC1.20 48.06,12.5 | 48.06,12.5 48.1,12.54 49.24,12.54 49.56,12.22 IC1.23 49.56,9.34 C19.2 | 48.06,12.5 48.06,14.33 47.31,15.08
  Top 0.406: C23.- 38.41,16.67 C22.2 | JP5.2 JP5.1 22.64,3.81 R25.1 23.44,5.93 C7.2 | 44.77,20.48 43.97,21.27 42.55,21.27 41.27,22.54 41.11,22.54 C20.2 C21.- 38.57,22.86 | JP16.1 JP2.1 JP14.1 6.35,46.04 | U$1.GND 66.36,18.89 62.87,22.38 56.04,22.38 54.61,20.95 54.61,18.41 54.14,17.94 C18.2 | 50.8,6.67 JP15.3 v48.61,2.7 45.88,2.7 U$4.GND | 50.8,6.67 50.8,7.3 50.16,7.94 C19.2 | C25.2 50.9,6.77 50.8,6.67 | R5.2 10.69,30.38 9.21,28.89 9.21,27.3 | C30.2 6.67,35.56 JP16.1 | U$3.12 55.54,27.28 | 55.54,27.28 U$3.C 56.84,28.58 U$3.3 59.38,28.58 59.69,28.89 59.69,30.16 60.01,30.48 63.5,30.48 | U$3.13 55.54,27.28 | U$2.GND 63.17,34.94 63.66,34.45 63.66,30.64 63.5,30.48 | 4.76,27.31 4.76,27.3 | 63.5,30.48 63.66,30.32 C15.2 66.2,25.87 v66.99,26.67 | C2.2 6.35,34.61 JP16.1 | C13.2 66.36,43.97 JP4.2 | C16.2 58.74,43.97 JP7.2 | C12.2 51.12,43.97 JP8.2 | C11.2 43.5,43.97 JP9.2 | C10.2 35.88,43.97 JP10.2 | C9.2 28.26,43.97 JP11.2 | C8.2 20.64,43.97 JP12.2 | C1.2 13.02,43.97 JP13.2 | v57.47,1.27 59.89,1.27 S1.3
  Top 0.61: 4.24,4.86 J1.3 | D3.A 9.68,21.75 9.21,22.22 9.21,27.3 IC2.6 4.76,27.3 0.95,27.3 | 0.95,20 0.95,7.3 3.4,4.86 4.24,4.86 | 0.95,20 0.95,23.18 | C29.2 0.95,23.18 | C28.- 0.95,20 | C27.- 17.94,12.86 C4.2 16.51,13.02 12.7,9.21 12.7,3.81 | J1.2 7.3,4.76 | 7.3,4.76 7.3,1.91 8.26,0.95 12.06,0.95 12.7,1.59 12.7,3.81 | 4.24,4.86 7.21,4.86 7.3,4.76 | 0.95,23.18 0.95,27.3 | 0.95,27.3 0.95,28.57 v1.27,28.89 | JP5.2 12.7,3.81
  Bottom 0.406: 66.67,44.45 66.2,44.45 JP4.2 | 6.35,45.72 JP14.1 JP2.1 6.35,38.42 | 6.35,38.42 JP16.1 6.67,35.56 6.99,35.56 6.99,36.19 C26.2 | 49.85,33.02 49.85,25.72 | 49.85,25.72 49.85,24.13 46.99,21.27 40.16,21.27 C21.- | 12.38,20.62 IC5.1 12.47,21.22 | C31.2 6.32,38.45 6.35,38.42 | R34.2 49.69,25.88 49.85,25.72 | v48.61,2.7 48.61,1.87 49.85,0.64 56.83,0.64 v57.47,1.27
  Bottom 0.61: JP4.2 66.04,45.88 65.72,46.2 58.42,46.2 | 58.42,46.2 51.12,46.2 | 51.12,46.2 43.5,46.2 | 43.5,46.2 35.24,46.2 | 35.24,46.2 27.94,46.2 | 27.94,46.2 20.32,46.2 | 20.32,46.2 12.7,46.2 | JP13.2 12.7,46.2 | JP12.2 20.32,46.2 | JP11.2 27.94,46.2 | JP10.2 35.56,45.88 35.24,46.2 | JP9.2 43.18,45.88 43.5,46.2 | JP8.2 50.8,45.88 51.12,46.2 | JP7.2 58.42,46.2 | 66.99,33.02 49.85,33.02 41.75,33.02 37.62,28.89 30.16,28.89 25.08,23.81 IC8.9 25.03,21.22 12.47,21.22 12.47,22.45 11.75,23.18 3.81,23.18 1.27,25.72 v1.27,28.89 | 66.99,33.02 67.63,33.65 67.63,43.5 66.67,44.45 | 12.7,46.2 6.35,46.2 JP14.1 | C6.2 10.79,17.78 12.38,19.37 12.38,20.62 | C5.2 14.92,21.27 | v66.99,26.67 66.99,33.02
  pour Bottom (isolate 0.406): 0,46.67 68.58,46.67 69.22,0 0,0
  pour Top (isolate 0.406, rank 2): 68.58,46.67 0,46.67 0,0 68.58,0
IN1
  Top 0.305: IC1.37 50.06,20.85 52.07,22.86
  Top 0.406: 52.07,22.86 52.07,30.16 48.58,33.65 47.41,33.65 R12.2
IN1_
  Top 0.406: RN1.9 R12.1 47.41,35.56 47.94,35.56 51.75,39.37 57.31,39.37 57.94,40 64.77,40 66.04,41.27 JP4.1 66.36,42.07 C13.1
IN2
  Top 0.305: IC1.38 49.56,21.14 51.28,22.86
  Top 0.406: 51.28,22.86 51.28,29.69 48.42,32.54 45.98,32.54 R13.2
IN2_
  Top 0.406: RN1.8 R13.1 44.87,35.56 45.4,35.56 46.04,36.19 46.04,39.05 46.35,39.37 50.64,39.37 51.44,40.16 56.83,40.16 JP7.1 58.74,42.07 C16.1
IN3
  Top 0.305: IC1.39 49.06,21.43 50.48,22.86
  Top 0.406: 50.48,22.86 50.48,29.21 47.94,31.75 44.23,31.75 R14.2
IN3_
  Top 0.406: RN1.7 R14.1 42.33,35.56 42.86,35.56 43.5,36.19 43.5,39.05 44.61,40.16 49.21,40.16 JP8.1 51.12,42.07 C12.1
IN4
  Top 0.305: IC1.40 48.56,21.73 49.69,22.86
  Top 0.406: 49.69,22.86 49.69,28.73 47.47,30.96 42.49,30.96 R15.2
IN4_
  Top 0.406: RN1.6 R15.1 39.79,35.56 40.32,35.56 40.96,36.19 40.96,39.37 43.18,41.59 JP9.1 43.5,42.07 C11.1
IN5
  Top 0.305: IC1.41 48.06,22.02 48.9,22.86
  Top 0.406: 48.9,22.86 48.9,28.26 46.99,30.16 40.74,30.16 R16.2
IN5_
  Top 0.406: JP10.1 37.31,41.75 37.78,41.27 | 37.78,41.27 38.42,40.64 38.42,36.19 37.84,35.62 R16.1 RN1.5 | C10.1 38.42,41.91 37.78,41.27
IN6
  Top 0.305: IC1.42 47.56,22.32 48.1,22.86
  Top 0.406: 48.1,22.86 48.1,27.78 46.51,29.37 35.5,29.37 R17.2
IN6_
  Top 0.406: 30.8,41.75 30.96,41.75 33.34,39.37 33.34,34.61 34.19,33.76 R9.1 R17.1 | 30.8,41.75 JP11.1 | C9.1 30.8,41.75
IN7
  Top 0.305: IC1.43 47.06,22.61 47.31,22.86
  Top 0.406: 47.31,22.86 47.31,27.46 46.2,28.57 33.66,28.57 32.07,30.16 R19.2
IN7_
  Top 0.406: 21.99,41.04 22.7,40.32 29.84,40.32 30.8,39.37 30.8,34.61 31.43,33.97 31.85,33.97 R10.1 R19.1 | 21.99,41.04 21.27,41.75 JP12.1 | C8.1 23.02,42.07 21.99,41.04
IN8
  Top 0.305: IC1.45 46.06,23.47 45.56,23.97
  Top 0.406: R22.2 29.53,30.16 31.91,27.78 43.81,27.78 43.97,27.62 43.97,24.45 44.45,23.97 45.56,23.97
IN8_
  Top 0.406: 13.34,41.75 15.56,39.53 27.78,39.53 28.26,39.05 28.26,34.61 28.89,33.97 29.31,33.97 R11.1 R22.1 | 13.34,41.75 JP13.1 | C1.1 13.65,42.07 13.34,41.75
IR  (via drill 0.5 pad 1.5)
  Top 0.305: v48.74,5.08 49.06,5.4 IC1.22
  Top 0.406: R20.2 3.07,36.61 JP16.2 | v20.32,19.68 v20.32,22.86
  Bottom 0.406: JP16.2 3.81,33.97 5.4,32.38 17.78,32.38 20.32,29.84 v20.32,22.86 | v20.32,19.68 20.32,18.1 22.86,15.56 22.86,10.48 32.38,0.95 46.35,0.95 46.99,1.59 46.99,4.13 47.94,5.08 v48.74,5.08
LED
  Top 0.305: IC1.28 52.84,13.83 55.72,10.95 55.72,8.73 56.83,7.62 61.59,7.62 62.55,8.57 62.55,9.21 63.24,9.9 R38.2
N$1
  Top 0.406: D3.C 6.86,22.86
  Top 0.61: 6.86,22.86 6.86,24.57 IC2.8 | L1.2 8.12,18.07 C3.2 7.62,19.23 7.62,20.98 D3.C
N$2
  Top 0.406: IC2.4 14.19,28.57 R5.1 14.29,26.77 R4.1
N$3
  Bottom 0.406: IC8.18 35.24,32.23 35.56,32.54 39.69,32.54 41.27,34.13 55.88,34.13 JP4.3
N$5
  Bottom 0.406: IC8.17 33.97,32.23 35.24,33.5 39.37,33.5 40.96,35.08 49.21,35.08 JP7.3
N$6
  Top 0.61: C3.1 13.34,18.73 13.97,19.37 13.97,24.13 13.34,24.76 IC2.1
N$7
  Top 0.61: J1.1 10.4,6.03 | 10.4,6.03 10.4,6.12 | R3.1 7.94,13.65 10.79,11.11 10.79,6.43 10.4,6.03
N$11
  Bottom 0.406: IC8.16 32.7,32.23 34.92,34.45 39.05,34.45 40.96,36.35 40.96,39.21 41.59,39.85 46.35,39.85 JP8.3
N$12
  Top 0.406: RN1.4 R9.2
N$13
  Bottom 0.406: IC8.15 31.43,32.23 34.61,35.4 37.78,35.4 38.42,36.04 38.42,39.53 JP9.3
N$14
  Top 0.406: RN1.3 R10.2
N$15
  Top 0.406: RN1.2 R11.2
N$22
  cutout Top (isolate 0.406): 44.13,18.57 50.8,18.57 50.8,11.91 44.13,11.91
  cutout Top (isolate 0.406): 60.33,37.94 68.58,37.94 68.58,29.05 60.33,29.05
N$23
  Bottom 0.406: IC8.14 30.16,32.23 33.34,35.4 33.34,41.43 JP10.3
N$24
  Bottom 0.406: IC8.13 28.89,32.23 25.4,35.72 JP11.3
N$25
  Bottom 0.406: IC8.12 27.62,32.23 24.45,35.56 24.45,38.1 22.23,40.32 19.21,40.32 JP12.3
N$26
  Top 0.305: R38.1 65.36,8.2 LED2.C
N$29
  Bottom 0.406: IC8.11 26.35,32.23 23.81,34.93 23.5,35.24 23.5,37.78 21.91,39.37 12.54,39.37 JP13.3
N$31
  Top 0.406: JP2.2 3.81,41.59
  Bottom 0.406: R23.1 8.68,33.65 5.4,33.65 5.08,33.97 5.08,40 JP2.2
N$32
  Top 0.406: JP14.2 5.08,43.5 5.08,38.73 R31.1
N$38
  Top 0.406: U$2.D- 58.74,32.54 R35.1
N$39
  Top 0.406: U$3.7 56.19,32.24 R35.2
N$40
  Top 0.406: U$3.6 56.84,35.15 R36.2
N$41
  Top 0.406: U$2.D+ 60.01,33.34 59.69,33.65 59.69,34.19 R36.1
N$64
  Top 0.305: IC1.44 46.56,24.88
  Top 0.406: JP17.2 45.24,26.19 46.56,24.88
  Bottom 0.406: JP17.2 R34.1
OUT1  (via drill 0.5 pad 1.5)
  Top 0.305: IC1.4 41.89,16.33 v41.2,15.64
  Bottom 0.406: v41.2,15.64 39.61,15.64 35.24,20 IC8.1 35.29,21.16
OUT2  (via drill 0.5 pad 1.5)
  Top 0.305: v40.01,6.03 40.8,6.03 41.59,6.83 45.88,6.83 47.56,8.5 IC1.19
  Bottom 0.406: v40.01,6.03 40.01,7.3 34.77,12.54 34.77,19.37 33.97,20.16 IC8.2
OUT3  (via drill 0.5 pad 1.5)
  Top 0.305: v39.05,3.97 38.73,4.29 38.73,6.98 39.05,7.3 45.56,7.3 47.06,8.8 IC1.18
  Bottom 0.406: v39.05,3.97 38.73,4.29 38.73,7.46 33.97,12.22 33.97,18.89 32.7,20.16 IC8.3
OUT4  (via drill 0.5 pad 1.5)
  Top 0.305: v37.47,6.03 37.47,6.51 38.73,7.78 45.24,7.78 46.56,9.09 IC1.17
  Bottom 0.406: v37.47,6.03 37.47,7.62 33.18,11.91 33.18,18.41 31.43,20.16 IC8.4
OUT5  (via drill 0.5 pad 1.5)
  Top 0.305: v36.83,3.97 36.2,4.6 36.2,6.98 37.47,8.25 44.93,8.25 46.06,9.39 IC1.16
  Bottom 0.406: v36.83,3.97 36.2,4.6 36.2,7.78 32.38,11.59 32.38,17.94 30.16,20.16 IC8.5
OUT6  (via drill 0.5 pad 1.5)
  Top 0.305: v34.92,6.03 34.92,6.51 37.15,8.73 44.61,8.73 45.56,9.68 IC1.15
  Bottom 0.406: v34.92,6.03 34.92,7.94 31.59,11.27 31.59,17.46 28.89,20.16 IC8.6
OUT7  (via drill 0.5 pad 1.5)
  Top 0.305: v49.53,13.97 49.53,13.34 49.85,13.02 50.53,12.33 IC1.25
  Bottom 0.406: IC8.7 27.62,22.7 28.42,23.5 35.88,23.5 36.51,22.86 36.51,20 38.42,18.1 45.4,18.1 v49.53,13.97
OUT8  (via drill 0.5 pad 1.5)
  Top 0.305: IC1.46 45.56,21.59 v44.45,22.7
  Bottom 0.406: IC8.8 26.35,22.7 28.1,24.45 39.69,24.45 41.43,22.7 v44.45,22.7
OW
  Top 0.305: IC1.21 48.56,8.71 43.81,3.97 U$4.DQ
  Top 0.406: R39.2 53.34,4.66 JP15.2 53.34,0.95 52.86,0.48 44.93,0.48 43.81,1.59 U$4.DQ
RST1
  Top 0.305: IC1.7 44.04,14.83 44.45,15.24 44.45,17.94 43.97,18.41 42.07,18.41
  Top 0.406: 42.07,18.41 41.43,18.41 R33.2
RX  (via drill 0.5 pad 1.5)
  Top 0.305: IC1.31 54.2,15.33 59.69,9.84 59.85,9.84 v60.01,9.68
  Top 0.406: U$3.15 56.84,24.76 v57.15,24.45
  Bottom 0.406: v57.15,24.45 56.83,24.13 56.83,12.86 v60.01,9.68
TX  (via drill 0.5 pad 1.5)
  Top 0.305: IC1.30 53.75,14.83 57.63,10.95 v57.63,9.68
  Top 0.406: U$3.2 59.7,27.93 v61.59,26.04
  Bottom 0.406: v61.59,26.04 56.52,26.04 55.56,25.08 55.56,11.75 v57.63,9.68
VCC  (via drill 0.5 pad 1.5)
  Top 0.305: IC1.48 43.76,19.26 v42.86,19.84 | v51.75,20.16 51.75,18.09 IC1.36 | IC1.24 50.32,10.64 v51.44,10.64 52.07,10.63 C19.1 | IC1.9 39.39,13.83 38.42,14.76 38.41,14.76 C22.1
  Top 0.406: JP6.1 JP6.2 22.23,33.02 22.23,29.84 | 26.83,37.46 RN1.1 26.99,29.84 | 32.07,14.92 35.24,14.92 35.72,14.45 36.2,14.45 | JP14.3 JP2.3 | C19.1 52.6,8.2 C25.1 52.76,6.67 54.29,6.67 55.46,5.5 R39.1 55.88,4.66 55.88,3.49 | U$1.VCC 58.74,13.34 59.37,12.7 61.59,12.7 62.87,11.43 65.41,11.43 | 65.41,11.43 67.31,11.43 67.94,12.07 67.94,21.91 66.67,23.18 63.82,23.18 | 63.82,23.18 59.37,23.18 | 59.37,23.18 53.34,23.18 | v51.75,20.16 53.5,20.16 53.5,20 C18.1 53.34,23.18 | U$3.10 53.34,28.58 | U$3.8 U$3.9 53.52,29.23 53.34,29.05 53.34,28.58 | U$3.1 59.03,27.28 59.37,26.99 59.37,23.18 | 53.34,28.58 53.34,23.18 | 26.99,29.84 26.99,24.92 31.28,20.63 32.07,19.84 | R33.1 v42.86,19.84 | R33.1 39.05,19.84 | 39.05,19.84 C21.+ | R33.1 C20.1 | C22.1 36.2,14.45 | C23.+ 36.2,14.45 | 32.07,14.92 32.07,8.89 27.94,4.76 27.94,3.49 | 27.94,3.49 JP3.1 | 39.05,19.84 37.15,19.84 | 37.15,19.84 32.07,19.84 | 32.07,14.92 32.07,19.84 | JP15.1 55.88,3.49 | v19.05,28.89 20,29.84 22.23,29.84 | 22.23,29.84 26.99,29.84 | C15.1 63.66,23.34 63.82,23.18 | U$4.VDD 33.34,2.54 32.38,3.49 27.94,3.49 | JP17.1 39.21,25.88 37.15,23.81 37.15,19.84 | LED2.A 65.41,11.43 | R2.1 55.88,3.49
  Bottom 0.305: v51.75,20.16 51.44,19.84
  Bottom 0.406: v42.86,19.84 51.44,19.84 v51.44,10.64 | 2.54,38.58 2.54,39.37 1.27,40.64 JP2.3 JP14.3 | 2.54,38.58 2.54,33.97 5.08,31.43 16.83,31.43 19.05,29.21 v19.05,28.89 | C31.1 2.54,38.58
  Bottom 0.61: v19.05,28.89 19.05,28.26 15.55,24.76 C5.1 12.77,26.91 IC5.4
VCC_5V  (via drill 0.5 pad 1.5)
  Top 0.406: v17.14,28.89 17.14,27.62 16.3,26.77 R4.2 15.77,26.25 15.56,26.04 15.56,20.32 v18.1,17.78 19.68,16.19 C27.+ | 17.3,15.4 C4.1 | 13.49,15.56 L1.1 13.49,15.55 | R20.1 1.27,38.63 JP16.3 1.27,34.61 C2.1
  Top 0.61: 17.3,15.4 C27.+ 20.48,15.4 21.59,14.29 21.59,8.57 21.27,8.25 JP1.2 JP1.1 | C4.1 13.49,15.55
  Bottom 0.406: JP16.3 1.27,33.97 4.76,30.48 15.56,30.48 v17.14,28.89 | C6.1 | 7.94,20.62 IC5.3
  Bottom 0.61: C6.1 7.94,20.62 | v18.1,17.78 18.1,17.14 14.61,13.65 9.53,13.65 7.62,15.56 7.62,17.46 C6.1
VCC_12V  (via drill 0.5 pad 1.5)
  Top 0.61: JP4.4 63.5,46.2 55.88,46.2 | 55.88,46.2 48.26,46.2 | 48.26,46.2 40.64,46.2 | 40.64,46.2 33.02,46.2 | 33.02,46.2 25.4,46.2 | 25.4,46.2 17.78,46.2 | 17.78,46.2 10.16,46.2 JP13.4 9.68,44.29 8.57,43.18 8.57,40.96 9.21,40.32 10.79,40.32 11.43,39.69 11.43,35.56 9.84,33.97 9.21,33.97 v4.13,28.89 | JP12.4 17.78,46.2 | JP11.4 25.4,46.2 | JP10.4 33.02,46.2 | JP7.4 55.88,46.2 | JP8.4 48.26,46.2 | JP9.4 40.64,46.2 | IC2.7 3.81,26.04 v3.65,25.87 C29.1 3.97,22.86 C28.+ 4.95,19.02 R3.2
  Bottom 0.61: v3.65,25.87 3.65,28.41 v4.13,28.89
(copper drawn outside any net)
  shapes: Bottom area x16, Top area x16

### Text on the board
tNames: 3V3 | 5V | GND
bNames: 6 | 5 | 4 | 3 | 2 | 1 | 0 | 7 | G | V | IR | 3V3 | BOOT | 5V | LIGHT | OW | G | V | GND